# Altium schematic sheet 1_Power_Connector.SchDoc
size A3; DocumentNumber: 3; SheetNumber: 3; SheetTotal: 6; PageSetup: Record=PageOptions|CenterHorizontal=True|CenterVertical=True|PrintScale=1.01|XCorrection=1.00|YCorrection=1.00|PrintKind=0|BorderSize=5000000|LeftOffset=0|BottomOffset=0|Orientation=2|PaperLength=1000|PaperWidth=1000|Scale=100|PaperSource=7|PrintQuality=-4|MediaType=1|DitherType=10|PaperKind=A3|PrintScaleMode=1
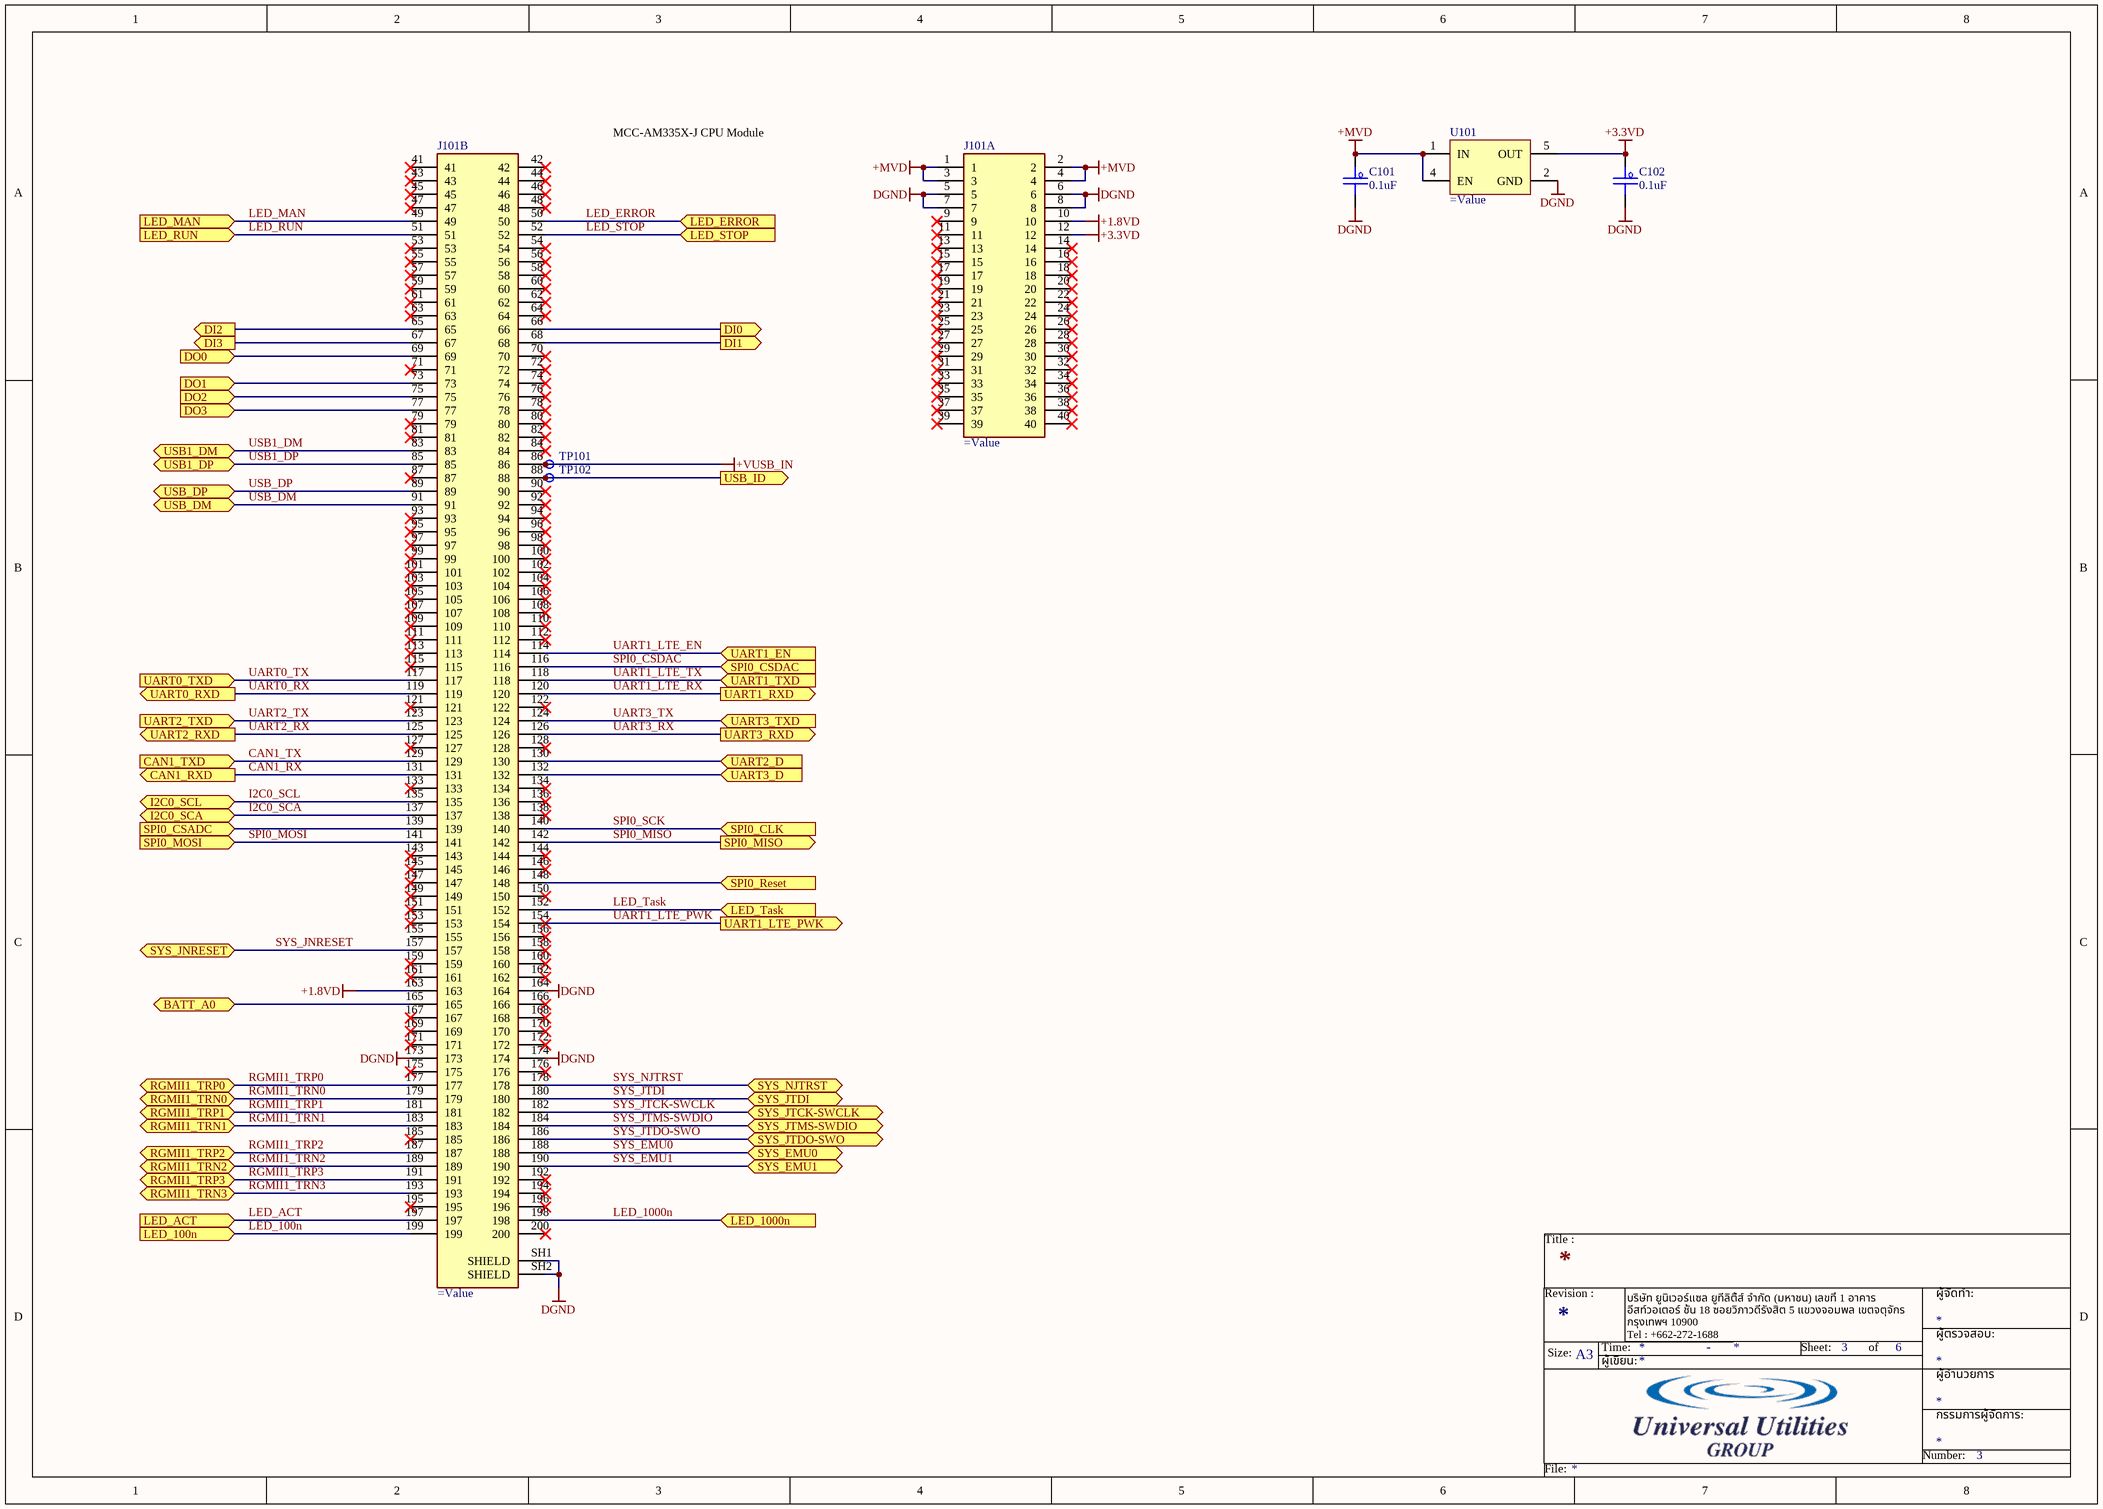
[diagram p0: 1_Power_Connector.SchDoc]

## Parts
C101  0.1uF  [C_0603]
C102  0.1uF  [C_0603]
J101  (no value)  [DDR2-SO-DIMM]  (parts A,B of 2)  (no BOM)
TP101  (no value)  [TP_Testpoint]  (no BOM)
TP102  (no value)  [TP_Testpoint]  (no BOM)
U101  (no value)  [SOT95P280X145-5N]

## Ports
BATT_A0 (bidir), CAN1_RXD (out), CAN1_TXD (in), DI0 (out), DI1 (out), DI2 (out), DI3 (out), DO0 (in), DO1 (in), DO2 (in), DO3 (in), I2C0_SCA (bidir), I2C0_SCL (bidir), LED_100n (in), LED_1000n (in), LED_ACT (in), LED_ERROR (in), LED_MAN (in), LED_RUN (in), LED_STOP (in), LED_Task (in), RGMII1_TRN0 (bidir), RGMII1_TRN1 (bidir), RGMII1_TRN2 (bidir), RGMII1_TRN3 (bidir), RGMII1_TRP0 (bidir), RGMII1_TRP1 (bidir), RGMII1_TRP2 (bidir), RGMII1_TRP3 (bidir), SPI0_CLK (in), SPI0_CSADC (in), SPI0_CSDAC (in), SPI0_MISO (out), SPI0_MOSI (in), SPI0_Reset (in), SYS_EMU0 (bidir), SYS_EMU1 (bidir), SYS_JNRESET (bidir), SYS_JTCK-SWCLK (bidir), SYS_JTDI (bidir), SYS_JTDO-SWO (bidir), SYS_JTMS-SWDIO (bidir), SYS_NJTRST (bidir), UART0_RXD (out), UART0_TXD (in), UART1_EN (in), UART1_LTE_PWK (out), UART1_RXD (out), UART1_TXD (in), UART2_D (in), UART2_RXD (out), UART2_TXD (in), UART3_D (in), UART3_RXD (out), UART3_TXD (in), USB1_DM (bidir), USB1_DP (bidir), USB_DM (bidir), USB_DP (bidir), USB_ID (out)

## Nets
+1.8VD: J101.10 J101.163
+3.3VD: C102.1 J101.12 U101.5(OUT)
+MVD: C101.1 J101.1 J101.2 J101.3 J101.4 U101.1(IN) U101.4(EN)
+VUSB_IN: J101.86 TP101.1
DGND: C101.2 C102.2 J101.5 J101.6 J101.7 J101.8 J101.164 J101.173 J101.174 J101.SH1(SHIELD) J101.SH2(SHIELD) U101.2(GND)
BATT_A0: J101.165 ; port BATT_A0
CAN1_RX: J101.131 ; port CAN1_RXD
CAN1_TX: J101.129 ; port CAN1_TXD
DI0: J101.66 ; port DI0
DI1: J101.68 ; port DI1
DI2: J101.65 ; port DI2
DI3: J101.67 ; port DI3
DO0: J101.69 ; port DO0
DO1: J101.73 ; port DO1
DO2: J101.75 ; port DO2
DO3: J101.77 ; port DO3
I2C0_SCA: J101.137 ; port I2C0_SCA
I2C0_SCL: J101.135 ; port I2C0_SCL
LED_100n: J101.199 ; port LED_100n
LED_1000n: J101.198 ; port LED_1000n
LED_ACT: J101.197 ; port LED_ACT
LED_ERROR: J101.50 ; port LED_ERROR
LED_MAN: J101.49 ; port LED_MAN
LED_RUN: J101.51 ; port LED_RUN
LED_STOP: J101.52 ; port LED_STOP
LED_Task: J101.152 ; port LED_Task
RGMII1_TRN0: J101.179 ; port RGMII1_TRN0
RGMII1_TRN1: J101.183 ; port RGMII1_TRN1
RGMII1_TRN2: J101.189 ; port RGMII1_TRN2
RGMII1_TRN3: J101.193 ; port RGMII1_TRN3
RGMII1_TRP0: J101.177 ; port RGMII1_TRP0
RGMII1_TRP1: J101.181 ; port RGMII1_TRP1
RGMII1_TRP2: J101.187 ; port RGMII1_TRP2
RGMII1_TRP3: J101.191 ; port RGMII1_TRP3
SPI0_CSADC: J101.139 ; port SPI0_CSADC
SPI0_CSDAC: J101.116 ; port SPI0_CSDAC
SPI0_MISO: J101.142 ; port SPI0_MISO
SPI0_MOSI: J101.141 ; port SPI0_MOSI
SPI0_Reset: J101.148 ; port SPI0_Reset
SPI0_SCK: J101.140 ; port SPI0_CLK
SYS_EMU0: J101.188 ; port SYS_EMU0
SYS_EMU1: J101.190 ; port SYS_EMU1
SYS_JNRESET: J101.157 ; port SYS_JNRESET
SYS_JTCK-SWCLK: J101.182 ; port SYS_JTCK-SWCLK
SYS_JTDI: J101.180 ; port SYS_JTDI
SYS_JTDO-SWO: J101.186 ; port SYS_JTDO-SWO
SYS_JTMS-SWDIO: J101.184 ; port SYS_JTMS-SWDIO
SYS_NJTRST: J101.178 ; port SYS_NJTRST
UART0_RX: J101.119 ; port UART0_RXD
UART0_TX: J101.117 ; port UART0_TXD
UART1_LTE_EN: J101.114 ; port UART1_EN
UART1_LTE_PWK: J101.154 ; port UART1_LTE_PWK
UART1_LTE_RX: J101.120 ; port UART1_RXD
UART1_LTE_TX: J101.118 ; port UART1_TXD
UART2_D: J101.130 ; port UART2_D
UART2_RX: J101.125 ; port UART2_RXD
UART2_TX: J101.123 ; port UART2_TXD
UART3_D: J101.132 ; port UART3_D
UART3_RX: J101.126 ; port UART3_RXD
UART3_TX: J101.124 ; port UART3_TXD
USB1_DM: J101.83 ; port USB1_DM
USB1_DP: J101.85 ; port USB1_DP
USB_DM: J101.91 ; port USB_DM
USB_DP: J101.89 ; port USB_DP
USB_ID: J101.88 TP102.1 ; port USB_ID

Not connected (* = marked no-connect by the designer): J101 9* 11* 13* 14* 15* 16* 17* 18* 19* 20* 21* 22* 23* 24* 25* 26* 27* 28* 29* 30* 31* 32* 33* 34* 35* 36* 37* 38* 39* 40* 41* 42* 43* 44* 45* 46* 47* 48* 53* 54* 55* 56* 57* 58* 59* 60* 61* 62* 63* 64* 70* 71* 72* 74* 76* 78* 79* 80* 81* 82* 84* 87* 90* 92* 93* 94* 95* 96* 97* 98* 99* 100* 101* 102* 103* 104* 105* 106* 107* 108* 109* 110* 111* 112* 113* 115* 121* 122* 127* 128* 133* 134* 136* 138* 143* 144* 145* 146* 147* 149* 150* 151* 153* 155 156* 158* 159* 160* 161* 162* 166* 167* 168* 169* 170* 171* 172* 175* 176* 185* 192* 194* 195* 196* 200*

## Notes on the sheet
- MCC-AM335X-J CPU Module
- Title :
- Revision :
- ผู้จัดทำ:
- Size:
- A3
- Time:
- ผู้เขียน:
- บริษัท ยูนิเวอร์แซล ยูทีลิตี้ส์ จำกัด (มหาชน) เลขที่ 1 อาคาร อีสท์วอเตอร์ ชั้น 18 ซอยวิภาวดีรังสิต 5 แขวงจอมพล เขตจตุจักร กรุงเทพฯ 10900
  Tel : +662-272-1688
  Fax :+662-2721690-1
- -
- Sheet:
- of
- ผู้อำนวยการ
- ผู้ตรวจสอบ:
- Number:
- กรรมการผู้จัดการ:
- File:

## Library data of the parts
C101 C102 = C_Capacitor: CAP CER 0.1UF 50V X7R 0603; Manufacturer: KEMET; PartNumber: C0603C104K5RACTU; PackageReference: 0603; PartID: 399-5089-1-ND; Value2: 50V; Value: 0.1uF; Value3: *
J101 = CON_DDR2: CONN SKT SODIMM 200POS R/A SMD; PartNumber: 1473149-4; Manufacturer: TE Connectivity AMP Connectors; Value: 1473149-4; PartID: A114854-ND; PackageReference: *; Value2: *; Value3: *
TP101 TP102 = TP_TestPoint: TestPoint; Manufacturer: *; PackageReference: *; PartID: *; PartNumber: *; Value2: *; Value3: *
U101 = IC_LDO_RT9069-33GB: 200mA 360mV@(10mA) Fixed 3.3V~3.3V Positive 1 36V SOT-23-5 Linear Voltage Regulators (LDO) ROHS; Manufacturer: Richtek Tech; PartNumber: RT9069-33GB; PartID: C147969; PackageReference: SOT-23-5; Value: RT9069-33GB; Value2: *; Value3: *